# EAGLE design IO Shield_With_Power_Supply (EAGLE 6.4)
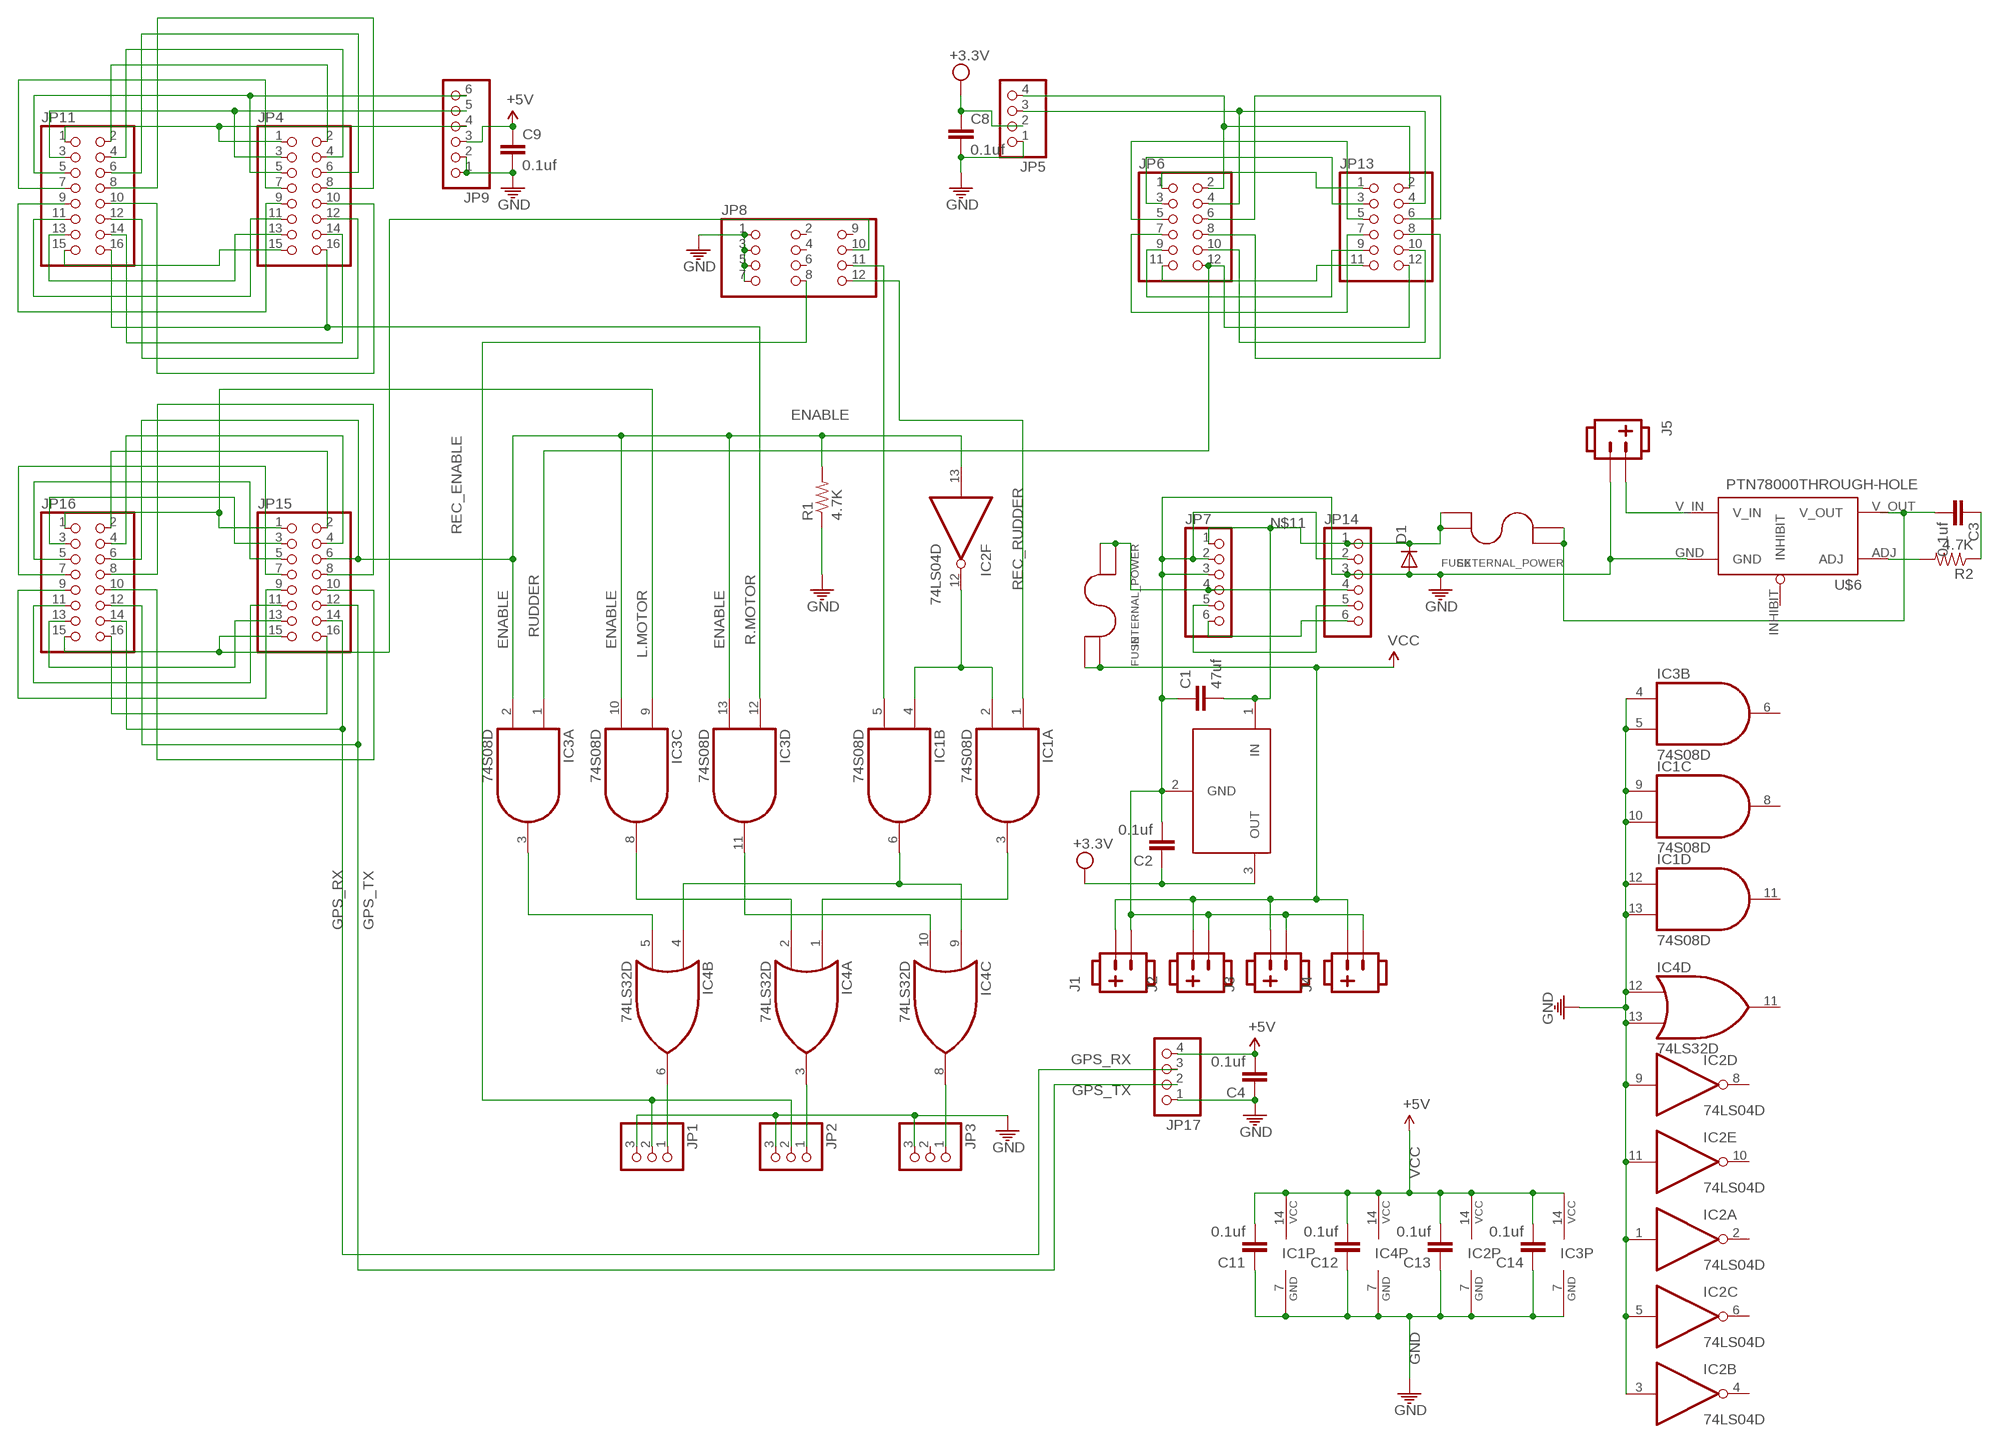
[diagram p0: schematic, sheet 1]

## Parts
C1  47uf  C-EUC0805  [C0805]
C2  0.1uf  C-EUC0805  [C0805]
C3  0.1uf  C-EUC0805  [C0805]
C4  0.1uf  C-EUC0805  [C0805]
C8  0.1uf  C-EUC0805  [C0805]
C9  0.1uf  C-EUC0805  [C0805]
C11  0.1uf  C-EUC0805  [C0805]
C12  0.1uf  C-EUC0805  [C0805]
C13  0.1uf  C-EUC0805  [C0805]
C14  0.1uf  C-EUC0805  [C0805]
D1  DIODEPTH  [DIODE-1N4001]
EXTERNAL_POWER  FUSE  [FUSE_2AG]
IC1  74S08D  [SO14]
IC2  74LS04D  [SO14]
IC3  74S08D  [SO14]
IC4  74LS32D  [SO14]
INTERNAL_POWER  FUSE  [FUSE_2AG]
J1  POW_CONNECTFEMALE-RA  [SOCKET-FEMALE_RA-3.96MM-2]
J2  POW_CONNECTFEMALE-RA  [SOCKET-FEMALE_RA-3.96MM-2]
J3  POW_CONNECTFEMALE-RA  [SOCKET-FEMALE_RA-3.96MM-2]
J4  POW_CONNECTFEMALE-RA  [SOCKET-FEMALE_RA-3.96MM-2]
J5  POW_CONNECTFEMALE-RA  [SOCKET-FEMALE_RA-3.96MM-2]
JP1  PINHD-1X3/90  [1X03/90]
JP2  PINHD-1X3/90  [1X03/90]
JP3  PINHD-1X3/90  [1X03/90]
JP4  PINHD-2X8  [2X08]
JP5  PINHD-1X4  [1X04]
JP6  PINHD-2X6  [2X06]
JP7  PINHD-1X6  [1X06]
JP8  PINHD-2X4  [2X04]
JP9  PINHD-1X6  [1X06]
JP11  PINHD-2X8  [2X08]
JP13  PINHD-2X6  [2X06]
JP14  PINHD-1X6  [1X06]
JP15  PINHD-2X8  [2X08]
JP16  PINHD-2X8  [2X08]
JP17  PINHD-1X4  [1X04]
R1  4.7K  RESISTOR0805-RES  [0805]
R2  4.7K  RESISTOR0805-RES  [0805]
U$1  LM3940IMP-3.3  [SOT223]
U$6  PTN78000THROUGH-HOLE  [PTN78000]

## Nets
ENABLE: IC2.13(F:I) IC3.2(A:I1) IC3.10(C:I1) IC3.13(D:I1) JP15.6 JP16.6 R1.2
GND: C1.1 C2.2 C4.1 C8.2 C9.2 C11.1 C12.1 C13.1 C14.1 D1.A IC1.7(P:GND) IC1.9(C:I0) IC1.10(C:I1) IC1.12(D:I0) IC1.13(D:I1) IC2.1(A:I) IC2.3(B:I) IC2.5(C:I) IC2.7(P:GND) IC2.9(D:I) IC2.11(E:I) IC3.4(B:I0) IC3.5(B:I1) IC3.7(P:GND) IC4.7(P:GND) IC4.12(D:I0) IC4.13(D:I1) J1.2 J2.2 J3.2 J4.2 J5.2 JP1.3 JP2.3 JP3.3 JP5.1 JP7.2 JP7.3 JP8.1 JP8.3 JP8.5 JP8.7 JP9.1 JP9.2 JP14.2 JP14.3 JP17.1 R1.1 U$1.2(GND) U$6.GND
GPS_RX: JP15.14 JP16.14 JP17.3
GPS_TX: JP15.12 JP16.12 JP17.2
L.MOTOR: IC3.9(C:I0) JP15.1 JP16.1
N$1: IC1.3(A:O) IC4.1(A:I0)
N$2: IC1.6(B:O) IC4.4(B:I0) IC4.9(C:I0)
N$3: IC1.2(A:I1) IC1.4(B:I0) IC2.12(F:O)
N$4: JP4.1 JP9.4 JP11.1
N$5: IC3.11(D:O) IC4.10(C:I1)
N$6: IC3.8(C:O) IC4.2(A:I1)
N$7: IC3.3(A:O) IC4.5(B:I1)
N$8: IC4.6(B:O) JP1.1
N$9: IC4.3(A:O) JP2.1
N$10: IC4.8(C:O) JP3.1
N$11: C1.2 D1.C EXTERNAL_POWER.P$3 EXTERNAL_POWER.P$4 JP7.1 JP14.1 U$1.1(IN)
N$12: JP1.2 JP2.2 JP8.8
N$13: C3.2 EXTERNAL_POWER.P$1 EXTERNAL_POWER.P$2 U$6.V_OUT
N$14: JP8.10 JP15.15 JP16.15
N$15: JP6.1 JP13.1
N$16: J5.1 U$6.V_IN
N$17: JP4.3 JP9.5 JP11.3
N$18: JP4.5 JP9.6 JP11.5
N$19: JP4.7 JP11.7
N$20: JP4.15 JP11.15
N$21: JP4.13 JP11.13
N$22: JP4.11 JP11.11
N$23: JP4.9 JP11.9
N$24: JP4.2 JP11.2
N$25: JP4.4 JP11.4
N$26: JP4.6 JP11.6
N$27: JP4.8 JP11.8
N$28: JP4.14 JP11.14
N$29: JP4.12 JP11.12
N$30: JP4.10 JP11.10
N$31: JP6.3 JP13.3
N$32: JP15.3 JP16.3
N$33: JP15.5 JP16.5
N$34: JP15.7 JP16.7
N$35: R2.2 U$6.ADJ
N$36: JP15.13 JP16.13
N$37: JP15.11 JP16.11
N$38: JP15.9 JP16.9
N$39: JP15.2 JP16.2
N$40: JP15.4 JP16.4
N$41: JP6.5 JP13.5
N$42: JP15.8 JP16.8
N$43: C3.1 R2.1
N$44: INTERNAL_POWER.P$1 INTERNAL_POWER.P$2 JP7.4 JP14.4
N$45: JP15.10 JP16.10
N$46: JP6.7 JP13.7
N$47: JP6.9 JP13.9
N$48: JP6.11 JP13.11
N$49: JP5.4 JP6.2 JP13.2
N$50: JP5.3 JP6.4 JP13.4
N$51: JP6.6 JP13.6
N$52: JP6.8 JP13.8
N$53: JP6.10 JP13.10
N$58: JP7.5 JP14.5
N$59: JP7.6 JP14.6
R.MOTOR: IC3.12(D:I0) JP4.16 JP11.16
REC.MOTOR: IC1.5(B:I1) JP8.11
REC_ENABLE: JP15.16 JP16.16
REC_RUDDER: IC1.1(A:I0) JP8.12
RUDDER: IC3.1(A:I0) JP6.12 JP13.12
VCC: C4.2 C9.1 C11.2 C12.2 C13.2 C14.2 IC1.14(P:VCC) IC2.14(P:VCC) IC3.14(P:VCC) IC4.14(P:VCC) INTERNAL_POWER.P$3 INTERNAL_POWER.P$4 J1.1 J2.1 J3.1 J4.1 JP9.3 JP17.4 ; supply symbol labelled +5V
VDD: C2.1 C8.1 JP5.2 U$1.3(OUT) ; supply symbol labelled +3.3V
Unconnected: IC1.8(C:O) IC1.11(D:O) IC2.2(A:O) IC2.4(B:O) IC2.6(C:O) IC2.8(D:O) IC2.10(E:O) IC3.6(B:O) IC4.11(D:O) JP3.2 JP8.2 JP8.4 JP8.6 JP8.9 U$6.INHIBIT

## Library data of the parts
C1-C4 C8 C9 C11-C14 = resistor:C-EU: CAPACITOR, European symbol
D1 = ASL:DIODE: Diode These are standard reverse protection diodes and small signal diodes. SMA package can handle up to about 1A. SOD-323 can handle about 200mA. What the SOD-323 package when ordering, there are some mfgs out there that are 5-pin packages.
EXTERNAL_POWER INTERNAL_POWER = ASL:FUSE
IC1 IC3 = 74xx-us:74*08: Quad 2-input AND gate
IC2 = 74xx-us:74*04: Hex INVERTER
IC4 = 74xx-us:74*32: Quad 2-input OR gate
J1-J5 = ASL:POW_CONNECT
JP1-JP3 = pinhead:PINHD-1X3: PIN HEADER
JP4 JP11 JP15 JP16 = pinhead:PINHD-2X8: PIN HEADER
JP5 = SDLogger:PINHD-1X4: PIN HEADER
JP6 JP13 = pinhead:PINHD-2X6: PIN HEADER
JP7 JP14 = pinhead:PINHD-1X6: PIN HEADER
JP8 = pinhead:PINHD-2X4: PIN HEADER
JP9 = SDLogger:PINHD-1X6: PIN HEADER
JP17 = pinhead:PINHD-1X4: PIN HEADER
R1 R2 = ASL:RESISTOR: Resistor Basic schematic elements and footprints for 0603, 1206, and PTH resistors.
U$1 = LM3940:LM3940IMP-3.3: 1A Low Dropout Regulator for 5V to 3.3V Conversion
U$6 = ASL:PTN78000: This is the PTN78000 part by Texas Instruments. It's a 1.5A adjustable switching regulator.

## Board
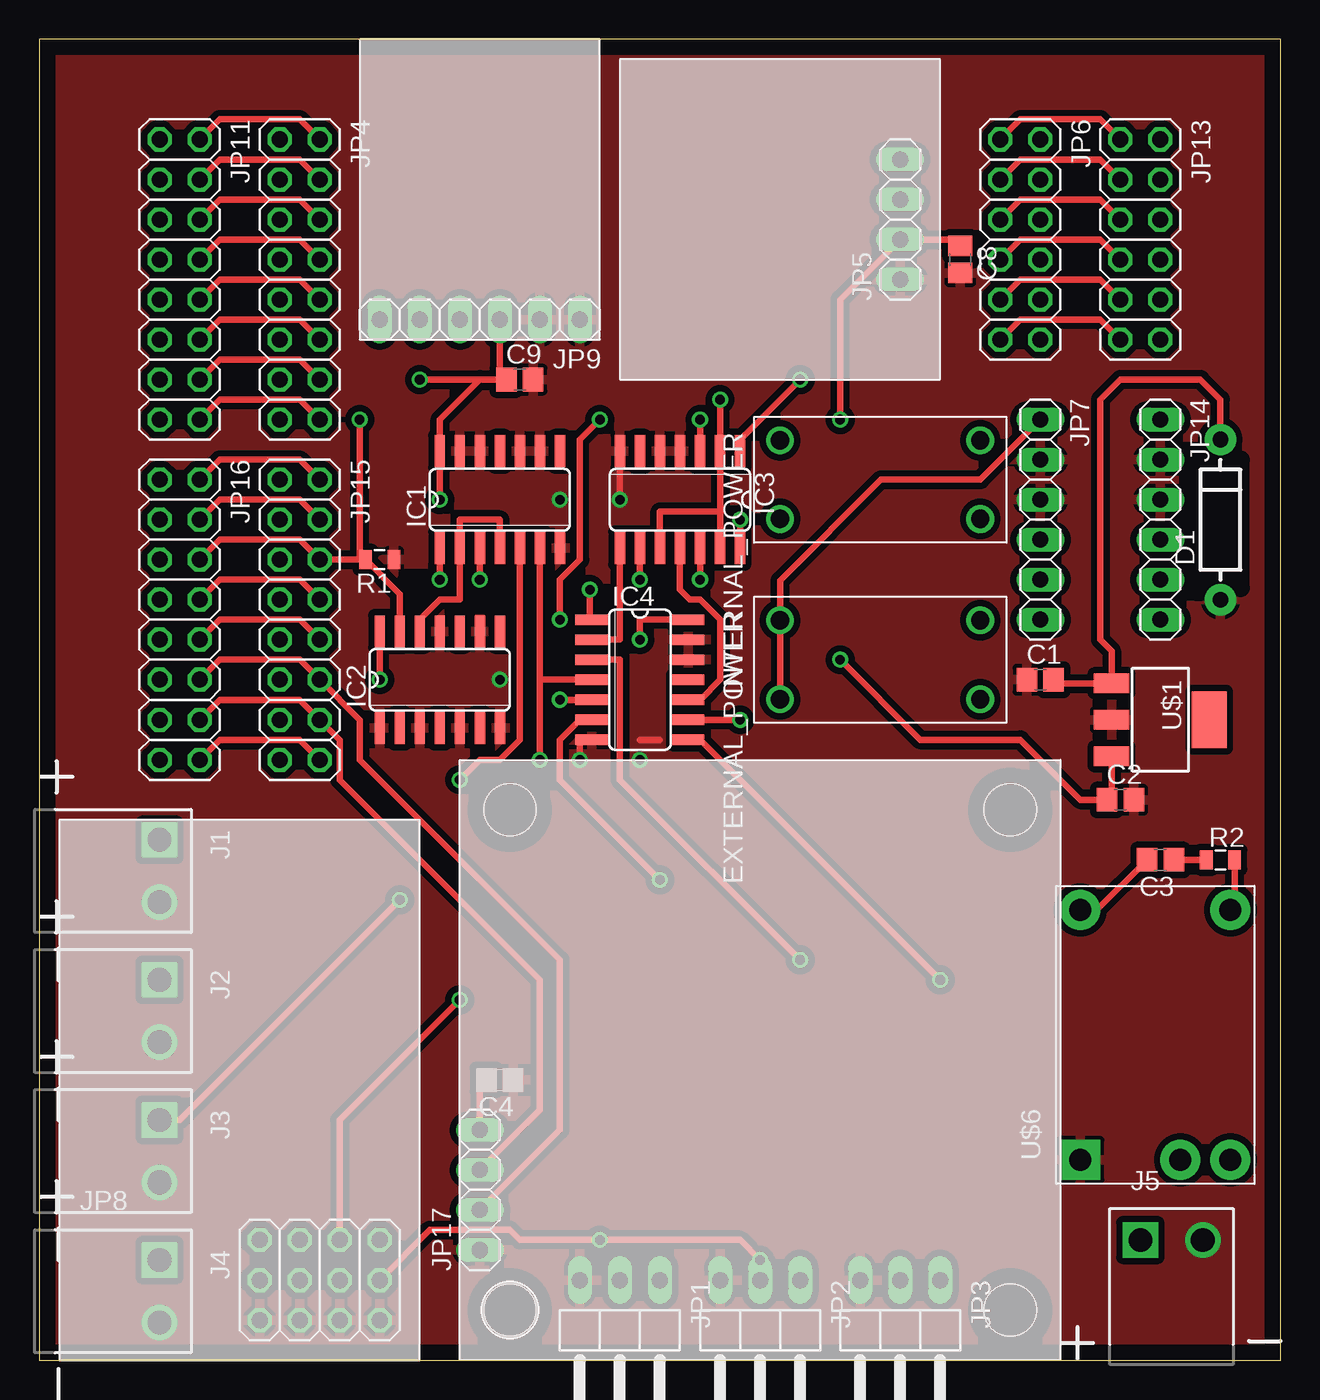
[diagram p1: board, top side]
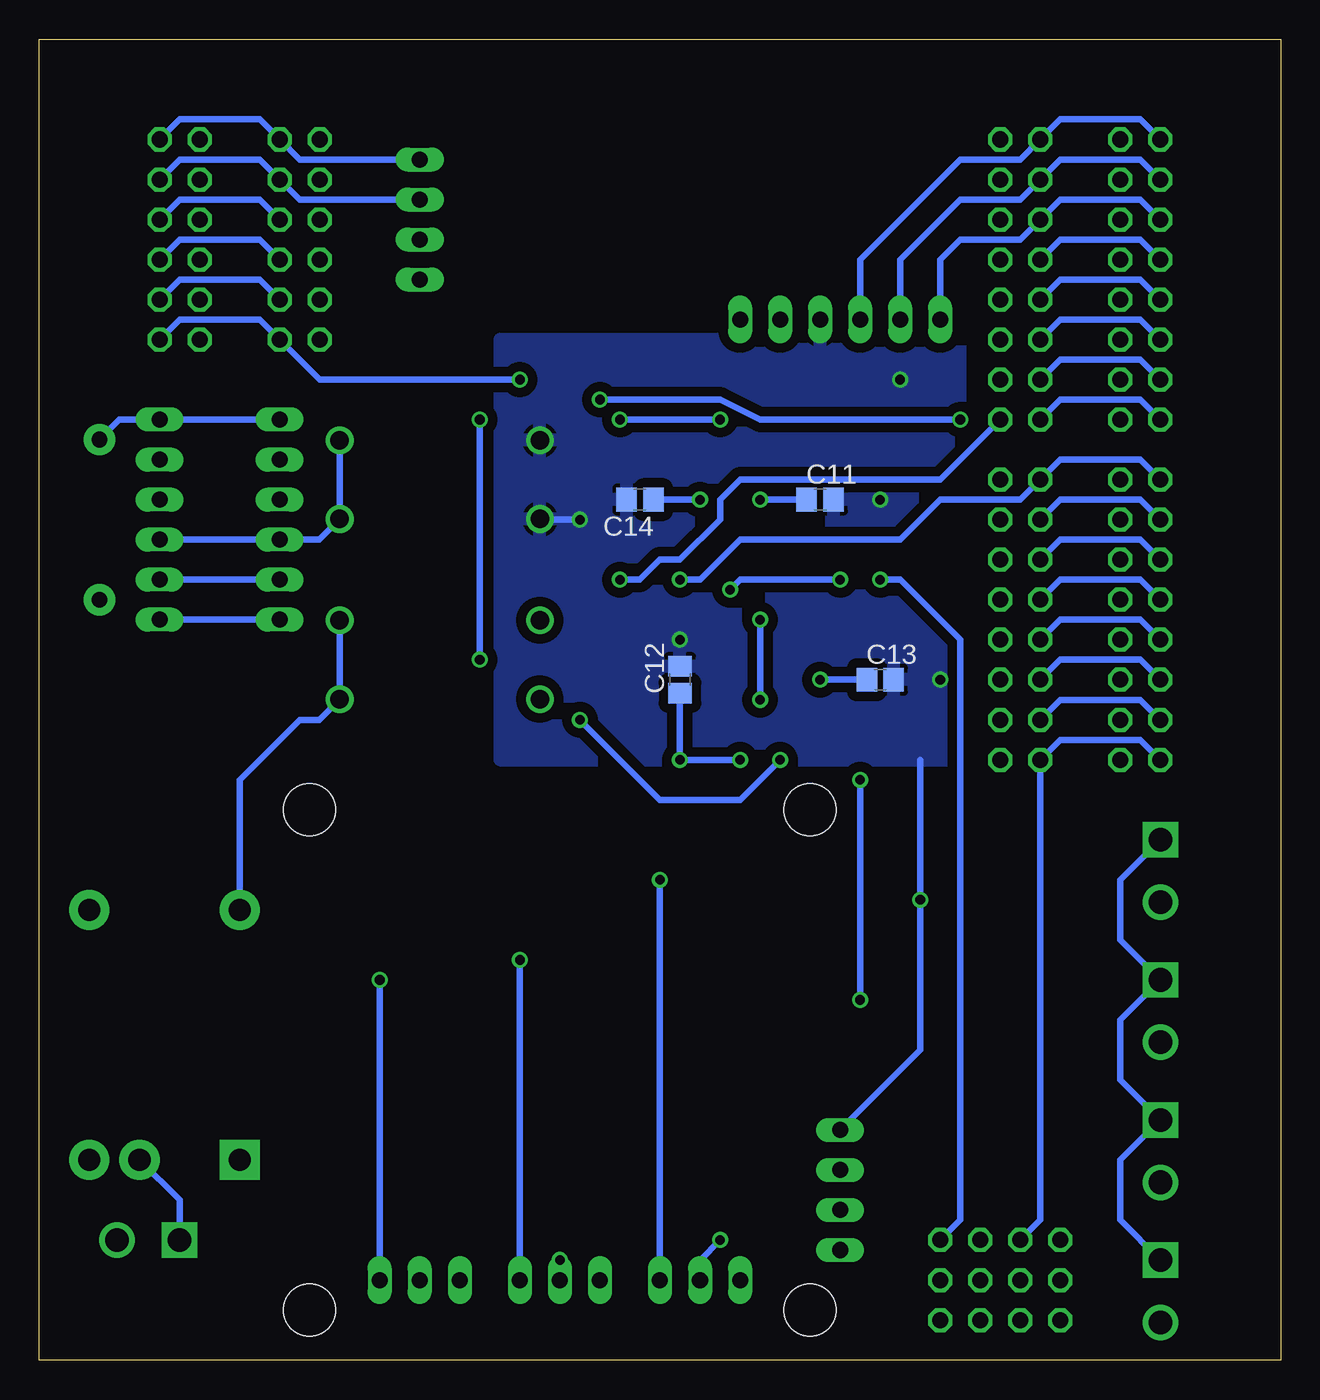
[diagram p2: board, bottom side, seen from below]

Size 78.74 x 83.82 mm. Coordinates in mm from the lower left corner, seen from the top.
Outline: 0,0 78.74,0 78.74,83.82 0,83.82 0,0
Copper layers (1*16): Top 0.035mm / dielectric 1.5mm / Bottom 0.035mm
Design rules "default": minimum track width 10mil, minimum drill 24mil, track to track 8mil, track to pad 8mil, pad to pad 8mil, via to via 8mil, smd to smd 8mil, copper to edge 40mil, drill to drill 8mil, minimum pad ring 10mil, minimum via ring 8mil, stop-mask expansion 4mil, vias tented up to drill 0mil, thermal gap 10mil
tRestrict: area 27.4,47.8 to 29.7,48.8; area 23.4,48 to 24.6,49.8; area 72.9,48.8 to 76.2,57.7

### Footprints (pad centres in the part's own frame; a part is rotated, then mirrored left to right if it is on the bottom)
C0805 = smd 1.3 x 1.5: 1 -0.85,0; 2 0.85,0
DIODE-1N4001 = drill 1 pad 1.981: A -5.08,0; C 5.08,0
FUSE_2AG = drill 1.17: P$1 -2.5,6.35; P$2 2.5,6.35; P$3 -2.5,-6.35; P$4 2.5,-6.35
SO14 = smd 0.66 x 2.032: 1 -3.81,-3.073; 2 -2.54,-3.073; 3 -1.27,-3.073; 4 0,-3.073; 5 1.27,-3.073; 6 2.54,-3.073; 7 3.81,-3.073; 8 3.81,3.073; 9 2.54,3.073; 10 1.27,3.073; 11 0,3.073; 12 -1.27,3.073; 13 -2.54,3.073; 14 -3.81,3.073
SOCKET-FEMALE_RA-3.96MM-2 = drill 1.5 square: 1 0,0 | drill 1.5: 2 3.96,0
1X03/90 = drill 1.016 long: 1 -2.54,-3.81; 2 0,-3.81; 3 2.54,-3.81
2X08 = drill 1.016 octagon: 1 -8.89,-1.27; 2 -8.89,1.27; 3 -6.35,-1.27; 4 -6.35,1.27; 5 -3.81,-1.27; 6 -3.81,1.27; 7 -1.27,-1.27; 8 -1.27,1.27; 9 1.27,-1.27; 10 1.27,1.27; 11 3.81,-1.27; 12 3.81,1.27; 13 6.35,-1.27; 14 6.35,1.27; 15 8.89,-1.27; 16 8.89,1.27
1X04 = drill 1.016 long: 1 -3.81,0; 2 -1.27,0; 3 1.27,0; 4 3.81,0
2X06 = drill 1.016 octagon: 1 -6.35,-1.27; 2 -6.35,1.27; 3 -3.81,-1.27; 4 -3.81,1.27; 5 -1.27,-1.27; 6 -1.27,1.27; 7 1.27,-1.27; 8 1.27,1.27; 9 3.81,-1.27; 10 3.81,1.27; 11 6.35,-1.27; 12 6.35,1.27
1X06 = drill 1.016 long: 1 -6.35,0; 2 -3.81,0; 3 -1.27,0; 4 1.27,0; 5 3.81,0; 6 6.35,0
2X04 = drill 1.016 octagon: 1 6.35,-1.27; 2 6.35,1.27; 3 8.89,-1.27; 4 8.89,1.27; 5 11.43,-1.27; 6 11.43,1.27; 7 13.97,-1.27; 8 13.97,1.27; 9 6.35,3.81; 10 8.89,3.81; 11 11.43,3.81; 12 13.97,3.81
1X04' = drill 1.016 long: 1 -3.175,0; 2 -0.635,0; 3 1.905,0; 4 4.445,0
0805 = smd 0.8 x 1.2: 1 -0.9,0; 2 0.9,0
SOT223 = smd 1.219 x 2.235: 1 -2.311,-3.099; 2 0,-3.099; 3 2.311,-3.099 | smd 3.6 x 2.2: 4 0,3.099
STAND-OFF = hole 3.302: 0,0
PTN78000 = drill 1.397 pad 2.54: ADJ 15.875,-9.525; INHIBIT 0,-9.525; V_IN 0,-6.35; V_OUT 15.875,0 | drill 1.397 pad 2.54 square: GND 0,0

### Placement (x,y rotation side)
C1  63.5,43.18 0 top
C2  68.58,35.56 0 top
C3  71.12,31.75 180 top
C4  29.21,17.78 180 top
C8  58.42,69.85 270 top
C9  30.48,62.23 0 top
C11  29.21,54.61 0 bottom
C12  38.1,43.18 90 bottom
C13  25.4,43.18 0 bottom
C14  40.64,54.61 180 bottom
D1  74.93,53.34 90 top
EXTERNAL_POWER  53.34,44.45 270 top
IC1  29.21,54.61 0 top
IC2  25.4,43.18 0 top
IC3  40.64,54.61 180 top
IC4  38.1,43.18 270 top
INTERNAL_POWER  53.34,55.88 270 top
J1  7.62,33.02 270 top
J2  7.62,24.13 270 top
J3  7.62,15.24 270 top
J4  7.62,6.35 270 top
J5  69.85,7.62 0 top
JP1  36.83,1.27 180 top
JP2  45.72,1.27 180 top
JP3  54.61,1.27 180 top
JP4  16.51,68.58 270 top
JP5  54.61,72.39 90 top
JP6  62.23,71.12 270 top
JP7  63.5,53.34 270 top
JP8  7.62,3.81 0 top
JP9  27.94,66.04 180 top
JP11  8.89,68.58 270 top
JP13  69.85,71.12 270 top
JP14  71.12,53.34 270 top
JP15  16.51,46.99 270 top
JP16  8.89,46.99 270 top
JP17  [1X04']  27.94,10.16 90 top
R1  21.59,50.8 180 top
R2  74.93,31.75 0 top
U$1  71.12,40.64 270 top
U$2  [STAND-OFF]  61.59,3.17 0 top
U$3  [STAND-OFF]  29.85,3.17 0 top
U$4  [STAND-OFF]  29.85,34.93 0 top
U$5  [STAND-OFF]  61.59,34.93 0 top
U$6  66.04,12.7 90 top

### Tracks (layer width: path | path; a pad name or v marks a point on that pad's centre or on a via)
ENABLE  (via drill 0.61)
  Top 0.406: JP16.6 11.43,52.07 16.51,52.07 JP15.6 R1.2 | 43.18,53.85 IC3.13 | IC3.10 39.37,53.85 43.18,53.85 | v43.18,60.96 IC3.2 43.18,53.85 | IC2.13 22.86,48.63 R1.2 | R1.2 20.32,50.8 v20.32,59.69
  Bottom 0.406: v20.32,59.69 33.02,59.69 35.56,60.96 v43.18,60.96
GND  (via drill 0.61)
  Top 0.406: 38.1,39.37 39.37,39.37 | IC4.7 34.29,39.37 v34.29,38.1 | v36.83,54.61 IC3.7
  Bottom 0.406: v34.29,38.1 v38.1,38.1 C12.1 | C11.1 v33.02,54.61 | C13.1 v29.21,43.18 | C14.1 v36.83,54.61
  pour Top (isolate 0.406): 78.74,0 0,0 0,83.82 78.74,83.82
GPS_RX
  Top 0.406: JP16.14 11.43,41.91 16.51,41.91 JP15.14 19.05,39.37 19.05,36.83 31.75,24.13 31.75,15.88 JP17.3
GPS_TX
  Top 0.406: JP16.12 11.43,44.45 16.51,44.45 JP15.12 20.32,40.64 20.32,38.1 33.02,25.4 33.02,14.61 JP17.2
L.MOTOR  (via drill 0.61)
  Top 0.406: v38.1,49.53 IC3.9
  Bottom 0.406: JP16.1 8.89,57.15 13.97,57.15 JP15.1 16.51,54.61 21.59,54.61 24.13,52.07 34.29,52.07 36.83,49.53 v38.1,49.53
N$1  (via drill 0.61)
  Top 0.406: 27.94,50.8 IC1.3 v27.94,49.53 | IC4.1 34.92,46.99 v34.92,48.9
  Bottom 0.406: v34.92,48.9 34.29,49.53 v27.94,49.53
N$2  (via drill 0.61)
  Top 0.406: IC1.6 31.75,43.18 | 31.75,43.18 IC4.4 | v31.75,38.1 31.75,43.18 | v44.45,40.64 IC4.9
  Bottom 0.406: v44.45,40.64 39.37,35.56 34.29,35.56 v31.75,38.1
N$3
  Top 0.406: 29.21,50.8 IC1.4 29.21,53.34 26.67,53.34 IC1.2 26.67,48.26 25.4,48.26 24.13,46.99 IC2.12
N$4
  Bottom 0.406: JP11.1 8.89,78.74 13.97,78.74 JP4.1 16.51,76.2 20.32,76.2 26.67,69.85 JP9.4
N$5
  Top 0.406: IC4.10 41.91,41.91 43.18,43.18 43.18,46.99 41.91,48.26 41.27,48.26 40.64,48.9 IC3.11
N$6
  Top 0.406: IC3.8 36.83,45.72 IC4.2
N$7  (via drill 0.61)
  Top 0.406: v33.02,41.91 IC4.5 | v33.02,46.99 33.02,49.53 34.29,50.8 34.29,58.42 v35.56,59.69 | v41.91,59.69 IC3.3
  Bottom 0.406: v33.02,46.99 v33.02,41.91 | v35.56,59.69 v41.91,59.69
N$8  (via drill 0.61)
  Top 0.406: v39.37,30.48 33.02,36.83 33.02,39.37 34.29,40.64 IC4.6
  Bottom 0.406: v39.37,30.48 JP1.1
N$9  (via drill 0.61)
  Top 0.406: IC4.3 36.83,44.45 36.83,36.83 v48.26,25.4
  Bottom 0.406: v48.26,25.4 JP2.1
N$10  (via drill 0.61)
  Top 0.406: v57.15,24.13 41.91,39.37 IC4.8
  Bottom 0.406: v57.15,24.13 JP3.1
N$11
  Top 0.406: D1.C 74.93,60.96 73.66,62.23 68.58,62.23 67.31,60.96 67.31,45.72 68.02,45.01 U$1.1 64.58,42.95 C1.2 | JP7.1 59.69,55.88 53.38,55.88 46.99,49.49 EXTERNAL_POWER.P$3 EXTERNAL_POWER.P$4
  Bottom 0.406: JP7.1 JP14.1 73.66,59.69 D1.C
N$12  (via drill 0.61)
  Top 0.406: v45.72,6.35 44.45,7.62 v35.56,7.62 30.48,7.62 29.85,8.26 24.77,8.26 JP8.8
  Bottom 0.406: JP2.2 v45.72,6.35 | JP1.2 36.83,6.35 v35.56,7.62
N$13
  Top 0.406: C3.2 67.09,28.57 U$6.V_OUT
  Bottom 0.406: EXTERNAL_POWER.P$1 EXTERNAL_POWER.P$2 61,40.64 62.23,40.64 66.04,36.83 U$6.V_OUT
N$14
  Bottom 0.406: JP16.15 8.89,39.37 13.97,39.37 JP15.15 15.24,8.89 JP8.10
N$15
  Top 0.406: JP6.1 62.23,78.74 67.31,78.74 JP13.1
N$16
  Bottom 0.406: J5.1 69.85,10.16 U$6.V_IN
N$17
  Bottom 0.406: JP11.3 8.89,76.2 13.97,76.2 JP4.3 16.51,73.66 20.32,73.66 24.13,69.85 JP9.5
N$18
  Bottom 0.406: JP11.5 8.89,73.66 13.97,73.66 JP4.5 16.51,71.12 20.32,71.12 21.59,69.85 JP9.6
N$19
  Bottom 0.406: JP11.7 8.89,71.12 13.97,71.12 JP4.7
N$20
  Bottom 0.406: JP11.15 8.89,60.96 13.97,60.96 JP4.15
N$21
  Bottom 0.406: JP11.13 8.89,63.5 13.97,63.5 JP4.13
N$22
  Bottom 0.406: JP11.11 8.89,66.04 13.97,66.04 JP4.11
N$23
  Bottom 0.406: JP11.9 8.89,68.58 13.97,68.58 JP4.9
N$24
  Top 0.406: JP11.2 11.43,78.74 16.51,78.74 JP4.2
N$25
  Top 0.406: JP11.4 11.43,76.2 16.51,76.2 JP4.4
N$26
  Top 0.406: JP11.6 11.43,73.66 16.51,73.66 JP4.6
N$27
  Top 0.406: JP11.8 11.43,71.12 16.51,71.12 JP4.8
N$28
  Top 0.406: JP11.14 11.43,63.5 16.51,63.5 JP4.14
N$29
  Top 0.406: JP11.12 11.43,66.04 16.51,66.04 JP4.12
N$30
  Top 0.406: JP11.10 11.43,68.58 16.51,68.58 JP4.10
N$31
  Top 0.406: JP13.3 67.31,76.2 62.23,76.2 JP6.3
N$32
  Bottom 0.406: JP16.3 8.89,54.61 13.97,54.61 JP15.3
N$33
  Bottom 0.406: JP16.5 8.89,52.07 13.97,52.07 JP15.5
N$34
  Bottom 0.406: JP16.7 8.89,49.53 13.97,49.53 JP15.7
N$35
  Top 0.406: U$6.ADJ 75.83,28.84 R2.2
N$36
  Bottom 0.406: JP16.13 8.89,41.91 13.97,41.91 JP15.13
N$37
  Bottom 0.406: JP16.11 8.89,44.45 13.97,44.45 JP15.11
N$38
  Bottom 0.406: JP16.9 8.89,46.99 13.97,46.99 JP15.9
N$39
  Top 0.406: JP16.2 11.43,57.15 16.51,57.15 JP15.2
N$40
  Top 0.406: JP16.4 11.43,54.61 16.51,54.61 JP15.4
N$41
  Top 0.406: JP13.5 67.31,73.66 62.23,73.66 JP6.5
N$42
  Top 0.406: JP16.8 11.43,49.53 16.51,49.53 JP15.8
N$43
  Top 0.406: R2.1 C3.1
N$44
  Bottom 0.406: JP14.4 JP7.4 61,52.07 INTERNAL_POWER.P$2 INTERNAL_POWER.P$1
N$45
  Top 0.406: JP16.10 11.43,46.99 16.51,46.99 JP15.10
N$46
  Top 0.406: JP13.7 67.31,71.12 62.23,71.12 JP6.7
N$47
  Top 0.406: JP13.9 67.31,68.58 62.23,68.58 JP6.9
N$48
  Top 0.406: JP13.11 67.31,66.04 62.23,66.04 JP6.11
N$49
  Bottom 0.406: JP13.2 69.85,78.74 64.77,78.74 JP6.2 62.23,76.2 JP5.4
N$50
  Bottom 0.406: JP13.4 69.85,76.2 64.77,76.2 JP6.4 62.23,73.66 JP5.3
N$51
  Bottom 0.406: JP13.6 69.85,73.66 64.77,73.66 JP6.6
N$52
  Bottom 0.406: JP13.8 69.85,71.12 64.77,71.12 JP6.8
N$53
  Bottom 0.406: JP13.10 69.85,68.58 64.77,68.58 JP6.10
N$58
  Bottom 0.406: JP7.5 JP14.5
N$59
  Bottom 0.406: JP7.6 JP14.6
R.MOTOR  (via drill 0.61)
  Top 0.406: JP11.16 11.43,60.96 16.51,60.96 JP4.16 | v41.91,49.53 IC3.12
  Bottom 0.406: JP4.16 21.59,55.88 34.29,55.88 35.56,54.61 35.56,53.34 38.1,50.8 39.37,50.8 40.64,49.53 v41.91,49.53
REC.MOTOR  (via drill 0.61)
  Top 0.406: JP8.11 19.05,15.24 v26.67,22.86 | v26.67,36.83 27.94,38.1 29.21,38.1 30.48,39.37 IC1.5
  Bottom 0.406: v26.67,22.86 v26.67,36.83
REC_ENABLE
  Top 0.406: JP16.16 11.43,39.37 16.51,39.37 JP15.16
REC_RUDDER  (via drill 0.61)
  Top 0.406: v25.4,49.53 IC1.1
  Bottom 0.406: JP8.12 20.32,8.89 20.32,45.72 24.13,49.53 v25.4,49.53
RUDDER  (via drill 0.61)
  Top 0.406: v48.26,62.23 44.45,58.42 IC3.1
  Bottom 0.406: JP13.12 69.85,66.04 64.77,66.04 JP6.12 60.96,62.23 v48.26,62.23
VCC  (via drill 0.61)
  Top 0.406: v21.59,43.18 IC2.14 | IC4.14 38.1,46.99 v38.1,45.72 | C4.2 27.94,17.78 JP17.4 | JP9.3 29.21,62.65 C9.1 27.94,62.23 | IC3.14 v44.45,53.34 | J3.1 8.89,15.24 v22.86,29.21 | v25.4,54.61 IC1.14 25.4,59.69 27.94,62.23 | v24.13,62.23 27.94,62.23
  Bottom 0.406: v44.45,53.34 46.95,53.34 INTERNAL_POWER.P$4 | J4.1 10.16,8.89 10.16,12.7 J3.1 10.16,17.78 10.16,21.59 J2.1 10.16,26.67 10.16,30.48 J1.1 | JP17.4 22.86,19.68 v22.86,29.21 22.86,38.1
  pour Bottom (isolate 0.61): 49.53,64.77 49.53,38.1 20.32,38.1 20.32,64.77
VDD  (via drill 0.61)
  Top 0.406: C8.1 58,71.12 JP5.2 50.8,67.31 v50.8,59.69 | U$1.3 68.02,35.85 C2.1 66.04,35.56 62.23,39.37 55.88,39.37 v50.8,44.45
  Bottom 0.406: v50.8,44.45 v50.8,59.69